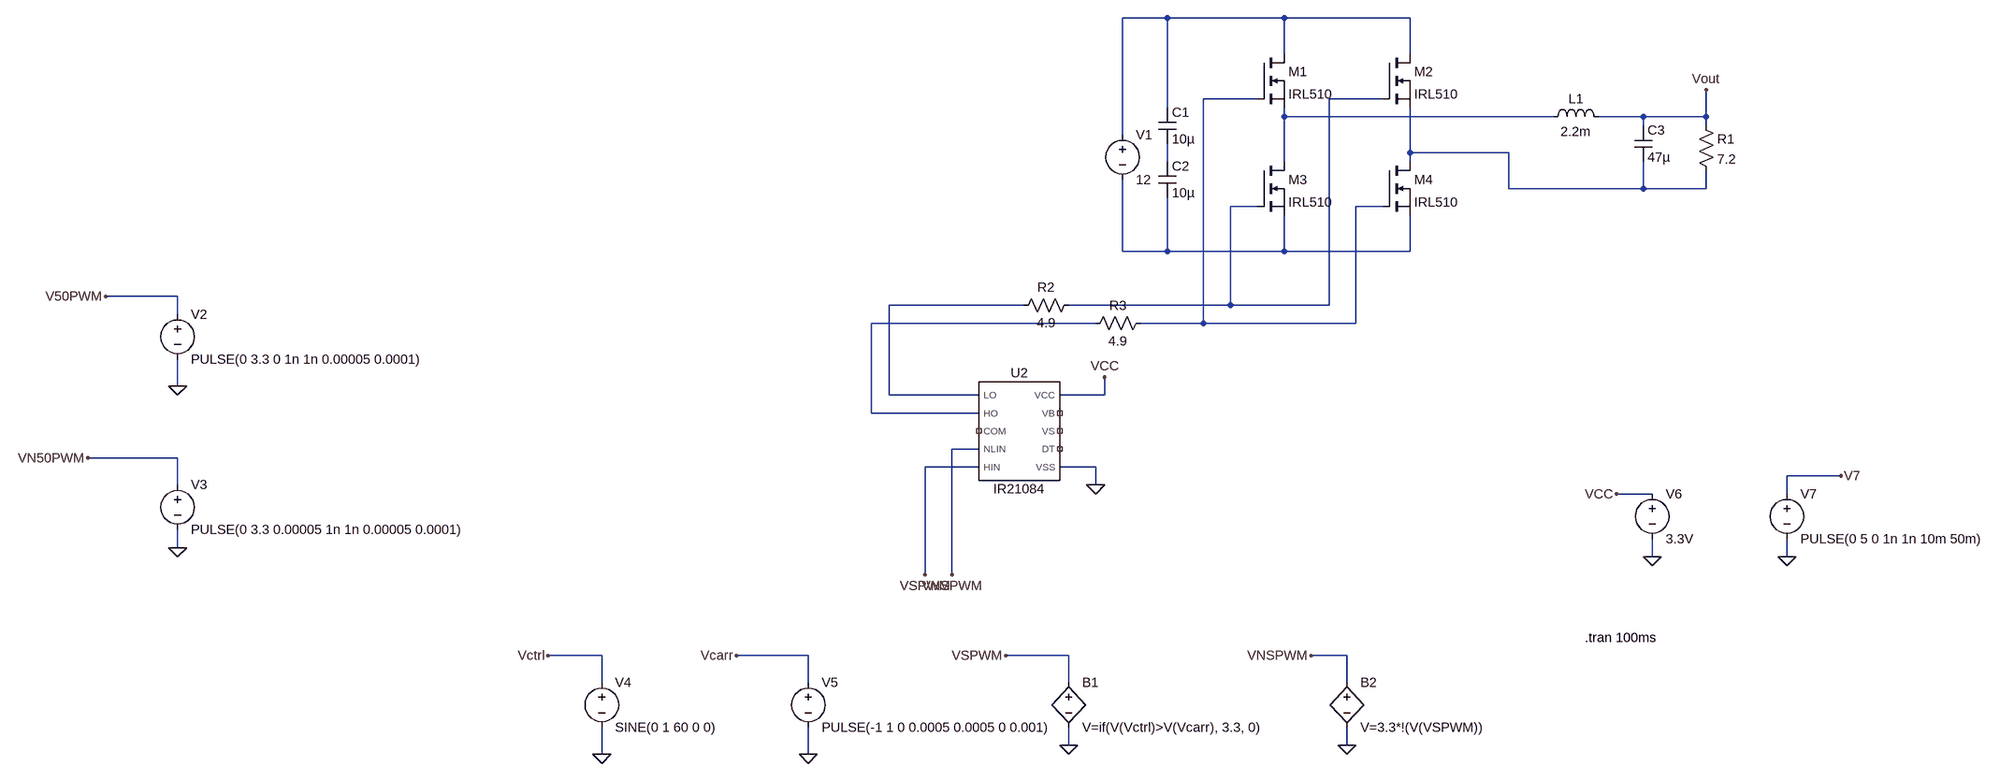
[diagram p0: schematic Capstone SPWM Inverter.asc]
Capstone SPWM Inverter.asc, the LTspice schematic file:
Version 4
SHEET 1 1524 1556
WIRE 16 -80 -64 -80
WIRE 224 -80 16 -80
WIRE 448 -80 224 -80
WIRE 224 -16 224 -80
WIRE 448 -16 448 -80
WIRE 176 64 80 64
WIRE 400 64 304 64
WIRE 16 80 16 -80
WIRE 224 96 224 80
WIRE 704 96 224 96
WIRE 864 96 784 96
WIRE 976 96 976 48
WIRE 976 96 864 96
WIRE 864 112 864 96
WIRE 976 112 976 96
WIRE -64 128 -64 -80
WIRE 448 160 448 80
WIRE 624 160 448 160
WIRE 16 176 16 144
WIRE 224 176 224 96
WIRE 448 176 448 160
WIRE 624 224 624 160
WIRE 864 224 864 176
WIRE 864 224 624 224
WIRE 976 224 976 192
WIRE 976 224 864 224
WIRE 176 256 128 256
WIRE 400 256 352 256
WIRE -64 336 -64 208
WIRE 16 336 16 240
WIRE 16 336 -64 336
WIRE 224 336 224 272
WIRE 224 336 16 336
WIRE 448 336 448 272
WIRE 448 336 224 336
WIRE -1808 416 -1936 416
WIRE -240 432 -480 432
WIRE 128 432 128 256
WIRE 128 432 -160 432
WIRE 304 432 304 64
WIRE 304 432 128 432
WIRE -1808 448 -1808 416
WIRE -112 464 -512 464
WIRE 80 464 80 64
WIRE 80 464 -32 464
WIRE 352 464 352 256
WIRE 352 464 80 464
WIRE -1808 576 -1808 528
WIRE -480 592 -480 432
WIRE -320 592 -480 592
WIRE -96 592 -96 560
WIRE -96 592 -176 592
WIRE -512 624 -512 464
WIRE -320 624 -512 624
WIRE -320 688 -368 688
WIRE -1808 704 -1968 704
WIRE -320 720 -416 720
WIRE -112 720 -176 720
WIRE 1216 736 1120 736
WIRE -1808 752 -1808 704
WIRE -112 752 -112 720
WIRE 880 768 816 768
WIRE 1120 768 1120 736
WIRE -1808 864 -1808 832
WIRE 880 880 880 848
WIRE 1120 880 1120 848
WIRE -416 912 -416 720
WIRE -368 912 -368 688
WIRE -992 1056 -1088 1056
WIRE -624 1056 -752 1056
WIRE -160 1056 -272 1056
WIRE 336 1056 272 1056
WIRE -992 1104 -992 1056
WIRE -624 1104 -624 1056
WIRE -160 1104 -160 1056
WIRE 336 1104 336 1056
WIRE -160 1216 -160 1184
WIRE 336 1216 336 1184
WIRE -992 1232 -992 1184
WIRE -624 1232 -624 1184
FLAG 976 48 Vout
FLAG -1808 576 0
FLAG -1936 416 V50PWM
FLAG -1968 704 VN50PWM
FLAG -1808 864 0
FLAG -992 1232 0
FLAG -624 1232 0
FLAG -1088 1056 Vctrl
FLAG -752 1056 Vcarr
FLAG -160 1216 0
FLAG -272 1056 VSPWM
FLAG -416 912 VSPWM
FLAG 336 1216 0
FLAG 272 1056 VNSPWM
FLAG -368 912 VNSPWM
FLAG 880 880 0
FLAG 816 768 VCC
FLAG -96 560 VCC
FLAG 1120 880 0
FLAG 1216 736 V7
FLAG -112 752 0
SYMBOL voltage -64 112 R0
WINDOW 123 0 0 Left 0
WINDOW 39 0 0 Left 0
SYMATTR InstName V1
SYMATTR Value 12
SYMBOL cap 0 80 R0
SYMATTR InstName C1
SYMATTR Value 10µ
SYMBOL cap 0 176 R0
SYMATTR InstName C2
SYMATTR Value 10µ
SYMBOL ind 688 112 R270
WINDOW 0 32 56 VTop 2
WINDOW 3 5 56 VBottom 2
SYMATTR InstName L1
SYMATTR Value 2.2m
SYMBOL cap 848 112 R0
SYMATTR InstName C3
SYMATTR Value 47µ
SYMBOL res 960 96 R0
SYMATTR InstName R1
SYMATTR Value 7.2
SYMBOL nmos 176 -16 R0
SYMATTR InstName M1
SYMATTR Value IRL510
SYMBOL nmos 400 -16 R0
SYMATTR InstName M2
SYMATTR Value IRL510
SYMBOL nmos 176 176 R0
SYMATTR InstName M3
SYMATTR Value IRL510
SYMBOL nmos 400 176 R0
SYMATTR InstName M4
SYMATTR Value IRL510
SYMBOL voltage -1808 432 R0
WINDOW 123 0 0 Left 0
WINDOW 39 0 0 Left 0
SYMATTR InstName V2
SYMATTR Value PULSE(0 3.3 0 1n 1n 0.00005 0.0001)
SYMBOL voltage -1808 736 R0
WINDOW 123 0 0 Left 0
WINDOW 39 0 0 Left 0
SYMATTR InstName V3
SYMATTR Value PULSE(0 3.3 0.00005 1n 1n 0.00005 0.0001)
SYMBOL voltage -992 1088 R0
WINDOW 123 0 0 Left 0
WINDOW 39 0 0 Left 0
SYMATTR InstName V4
SYMATTR Value SINE(0 1 60 0 0)
SYMBOL voltage -624 1088 R0
WINDOW 123 0 0 Left 0
WINDOW 39 0 0 Left 0
SYMATTR InstName V5
SYMATTR Value PULSE(-1 1 0 0.0005 0.0005 0 0.001)
SYMBOL bv -160 1088 R0
SYMATTR InstName B1
SYMATTR Value V=if(V(Vctrl)>V(Vcarr), 3.3, 0)
SYMBOL bv 336 1088 R0
SYMATTR InstName B2
SYMATTR Value V=3.3*!(V(VSPWM))
SYMBOL voltage 880 752 R0
WINDOW 123 0 0 Left 0
WINDOW 39 0 0 Left 0
SYMATTR InstName V6
SYMATTR Value 3.3V
SYMBOL res -144 416 R90
WINDOW 0 0 56 VBottom 2
WINDOW 3 32 56 VTop 2
SYMATTR InstName R2
SYMATTR Value 4.9
SYMBOL res -16 448 R90
WINDOW 0 0 56 VBottom 2
WINDOW 3 32 56 VTop 2
SYMATTR InstName R3
SYMATTR Value 4.9
SYMBOL voltage 1120 752 R0
WINDOW 123 0 0 Left 0
WINDOW 39 0 0 Left 0
SYMATTR InstName V7
SYMATTR Value PULSE(0 5 0 1n 1n 10m 50m)
SYMBOL IR21084S -256 656 R0
SYMATTR InstName U2
SYMATTR Value IR21084
TEXT 760 1024 Left 2 !.tran 100ms

The netlist it stands for:
* Capstone SPWM Inverter.asc
V1 N001 N007 12
C1 N001 N006 10µ
C2 N006 N007 10µ
L1 N004 Vout 2.2m
C3 Vout N005 47µ
R1 Vout N005 7.2
M1 N001 N002 N004 N004 IRL510
M2 N001 N003 N005 N005 IRL510
M3 N004 N003 N007 N007 IRL510
M4 N005 N002 N007 N007 IRL510
V2 V50PWM 0 PULSE(0 3.3 0 1n 1n 0.00005 0.0001)
V3 VN50PWM 0 PULSE(0 3.3 0.00005 1n 1n 0.00005 0.0001)
V4 Vctrl 0 SINE(0 1 60 0 0)
V5 Vcarr 0 PULSE(-1 1 0 0.0005 0.0005 0 0.001)
B1 VSPWM 0 V=if(V(Vctrl)>V(Vcarr), 3.3, 0)
B2 VNSPWM 0 V=3.3*!(V(VSPWM))
V6 VCC 0 3.3V
R2 N003 N008 4.9
R3 N002 N009 4.9
V7 V7 0 PULSE(0 5 0 1n 1n 10m 50m)
XU2 N008 N009 NC_01 VNSPWM VSPWM VCC NC_02 NC_03 NC_04 0 IR21084  ; pins LO HO COM NLIN HIN VCC VB VS DT VSS
.model NMOS NMOS
.model PMOS PMOS
.lib standard.mos
.tran 100ms
.lib C:\Users\Nicholas Chan\Downloads\Infineon-IR21084S-PSpice-SimulationModels-v01_00-EN\Model\IR21084S.lib
.backanno
.end